# EAGLE design Solar_Charger (EAGLE 9.6.2)
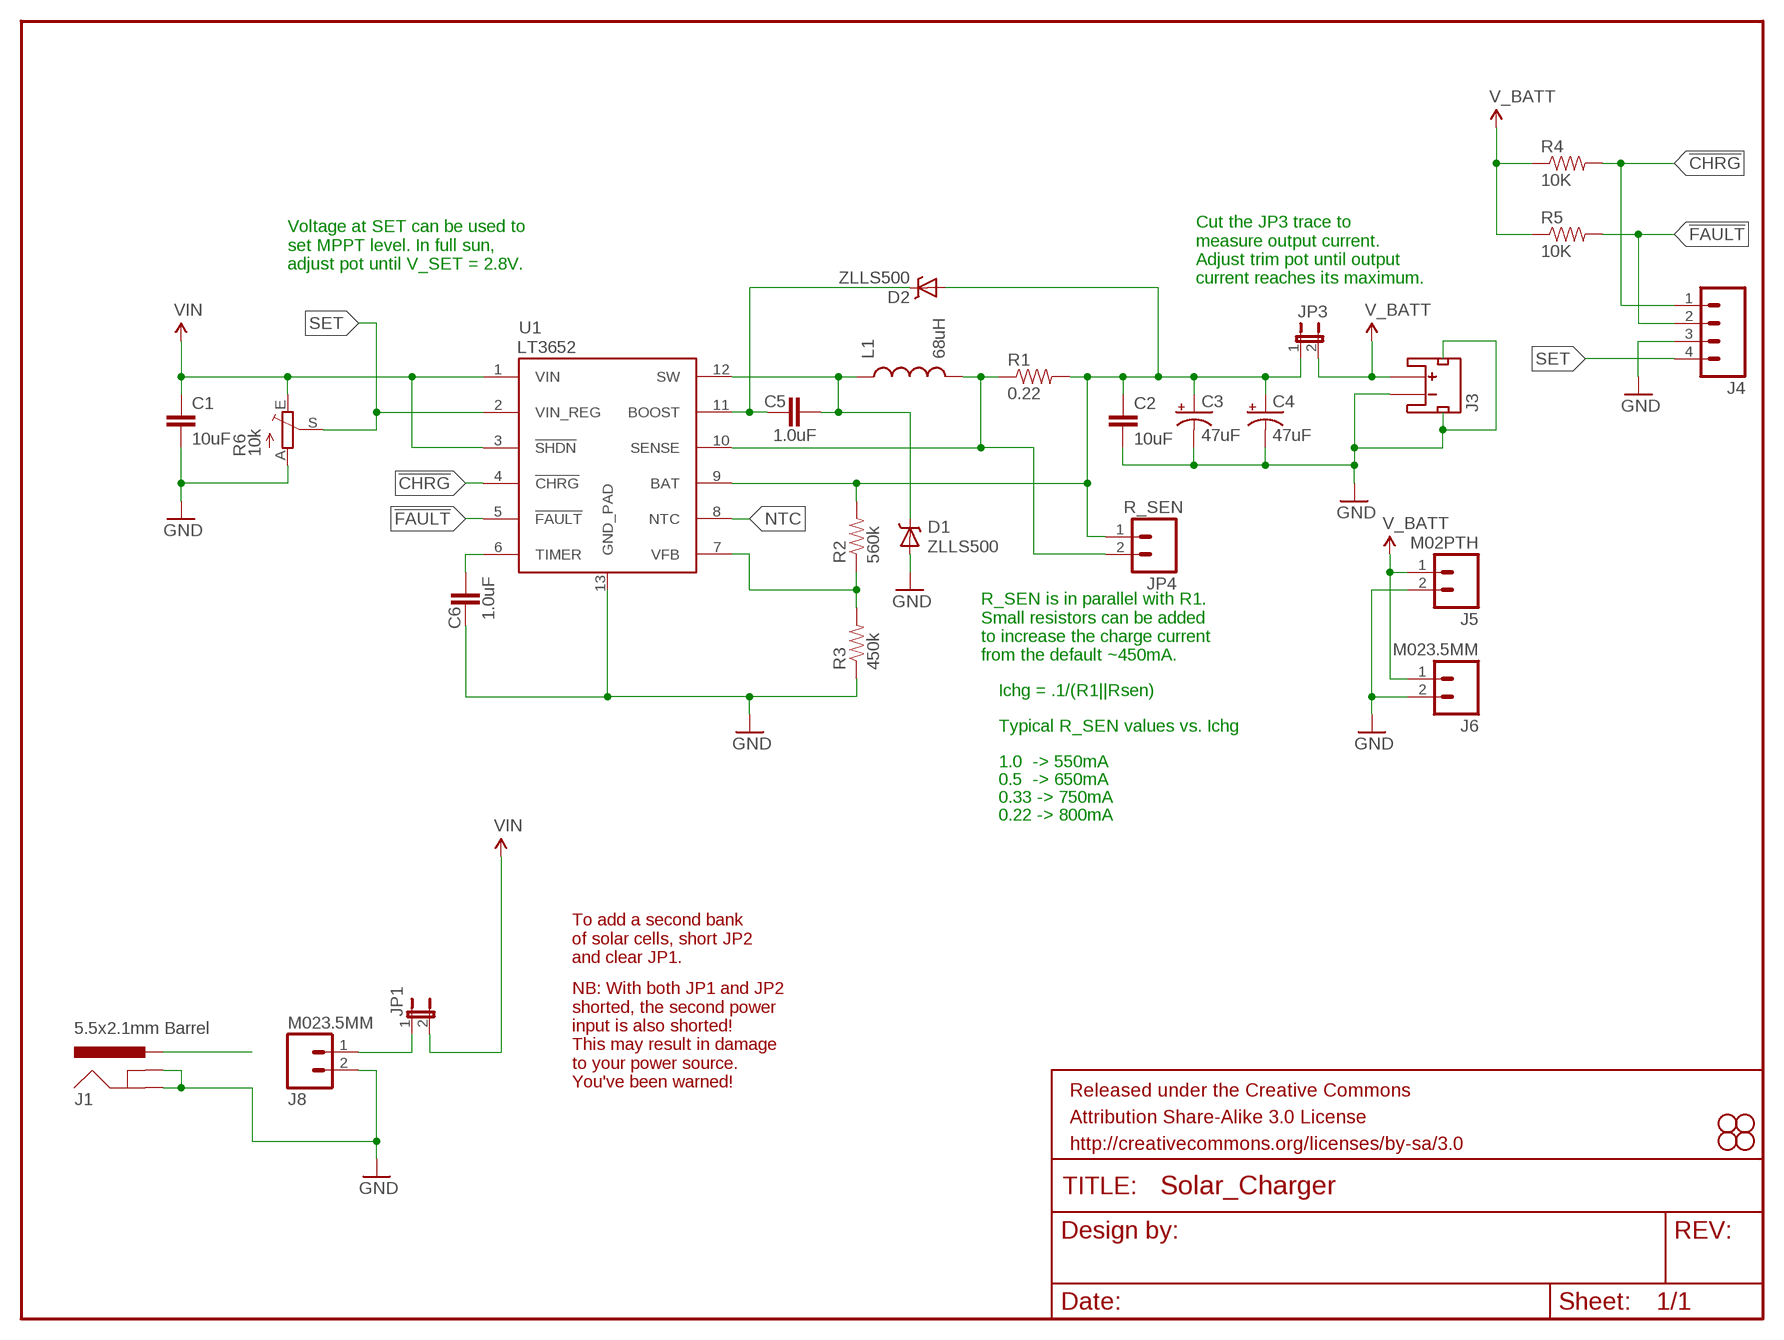
[diagram p0: schematic, sheet 1]

## Parts
C1  10uF  10UF50V20%(1210)  [1210]
C2  10uF  10UF-6.3V-20%(1206)  [1206]
C3  47uF  47UF-TANT  [EIA3528]
C4  47uF  47UF-TANT  [EIA3528]
C5  1.0uF  1.0UF-16V-10%(0603)  [0603-CAP]
C6  1.0uF  1.0UF-16V-10%(0603)  [0603-CAP]
D1  ZLLS500  ZLLS500ZLLS500  [SOT23]
D2  ZLLS500  ZLLS500ZLLS500  [SOT23]
FRAME1  FRAME-LETTER  [CREATIVE_COMMONS]
J1  5.5x2.1mm Barrel  POWER_JACKSMD  [POWER_JACK_SMD]
J3  JST_2MM_MALE  [JST-2-SMD]
J4  M04PTH  [1X04]
J5  M02PTH  [1X02]
J6  M023.5MM  [SCREWTERMINAL-3.5MM-2]
J8  M023.5MM  [SCREWTERMINAL-3.5MM-2]
JP1  JUMPER-2SMD-NC  [SJ_2S]
JP3  JUMPER-PTH-2-NC  [PTH-JUMPER-NC_BOTTOM_NO_SILK]
JP4  R_SEN  M02PTH  [1X02]
L1  68uH  INDUCTOR68UH-1A  [CR75]
R1  0.22  0.22OHM1/4W1%(0805)  [0805]
R2  560k  47KOHM1/10W1%(0603)  [0603-RES]
R3  450k  220KOHM1/10W1%(0603)  [0603-RES]
R4  10K  10KOHM1/10W1%(0603)0603  [0603-RES]
R5  10K  10KOHM1/10W1%(0603)0603  [0603-RES]
R6  10k  TRIM_EU-S63S  [S63S]
STANDOFF1  STAND-OFF  [STAND-OFF]
STANDOFF2  STAND-OFF  [STAND-OFF]
STANDOFF3  STAND-OFF  [STAND-OFF]
STANDOFF4  STAND-OFF  [STAND-OFF]
U1  LT3652  [MSOP-12_GND]

## Nets
!CHRG: J4.1 R4.2 U1.4(!CHRG)
!FAULT: J4.2 R5.2 U1.5(!FAULT)
BOOST: C5.1 D2.3(C) U1.11(BOOST)
FB: R2.1 R3.2 U1.7(VFB)
GND: C1.2 C2.2 C3.C(-) C4.C(-) C6.1 D1.1(A) J1.GND(GNDBREAK) J1.P$4(GND) J3.1(-) J3.NC1(PAD1) J3.NC2(PAD2) J4.3 J5.2 J6.2 J8.2 R3.1 R6.A U1.13(GND_PAD)
N$4: C2.1 C3.A(+) C4.A(+) D2.1(A) JP3.1 JP4.1 R1.2 R2.2 U1.9(BAT)
N$6: J1.VIN0(PWR)
N$8: J8.1 JP1.1
NTC: U1.8(NTC)
SENSE: JP4.2 L1.P$2 R1.1 U1.10(SENSE)
SET: J4.4 R6.S U1.2(VIN_REG)
SW: C5.2 D1.3(C) L1.P$1 U1.12(SW)
TIMER: C6.2 U1.6(TIMER)
V_BATT: J3.2(+) J5.1 J6.1 JP3.2 R4.1 R5.1
VIN: C1.1 JP1.2 R6.E U1.1(VIN) U1.3(!SHDN)

## Notes on the sheet
- Voltage at SET can be used to
  set MPPT level. In full sun,
  adjust pot until V_SET = 2.8V.
- Cut the JP3 trace to
  measure output current.
  Adjust trim pot until output
  current reaches its maximum.
- R_SEN is in parallel with R1.
  Small resistors can be added
  to increase the charge current
  from the default ~450mA.
- Ichg = .1/(R1||Rsen)
- Typical R_SEN values vs. Ichg
- 1.0  -> 550mA
- 0.5  -> 650mA
- 0.33 -> 750mA
- 0.22 -> 800mA
- To add a second bank
  of solar cells, short JP2
  and clear JP1.
- NB: With both JP1 and JP2
  shorted, the second power
  input is also shorted! 
  This may result in damage
  to your power source.
  You've been warned!

## Library data of the parts
C1 = SparkFun-Capacitors:10UF50V20%(1210): CAP-09824; PROD_ID: CAP-09824
C2 = SparkFun-Capacitors:10UF-6.3V-20%(1206): Ceramic CAP-10057; PROD_ID: CAP-10057
C3 C4 = SparkFun-Capacitors:47UF-TANT: 47uF Tantalum SMT CAP-08310- 10V 10% (EIA-3528); PROD_ID: CAP-08310
C5 C6 = SparkFun-Capacitors:1.0UF-16V-10%(0603): CAP-00868; PROD_ID: CAP-00868
D1 D2 = SparkFun-DiscreteSemi:ZLLS500: 700mA 40V SOT-23 Schottky; PROD_ID: DIO-08411
FRAME1 = SparkFun-Aesthetics:FRAME-LETTER: Schematic Frame Standard 8.5x11 US Letter frame
J1 = SparkFun-Connectors:POWER_JACK: Power Jack This is the standard 5.5mm barrel jack for power. The PTH is the most common, proven, reliable, footprint. The Slot footprint only works if the mill layer is transmitted to the PCB fab house so be warned. Spark Fun Electronics SKU : PRT-00119 SMT: CONN-08106 Mating wall wart : TOL-00298 (and others); PROD_ID: CONN-08106
J3 = SparkFun-Connectors:JST_2MM_MALE: Mates to single-cell LiPo batteries. CONN-08352; PROD_ID: CONN-08352
J4 = SparkFun-Connectors:M04: Header 4 Standard 4-pin 0.1" header. Use with straight break away headers (SKU : PRT-00116), right angle break away headers (PRT-00553), swiss pins (PRT-00743), machine pins (PRT-00117), and female headers (PRT-00115). Molex polarized connector foot print use with SKU : PRT-08231 with associated crimp pins and housings. 1MM SMD Version SKU: PRT-10208
J5 J6 J8 JP4 = SparkFun-Connectors:M02: Standard 2-pin 0.1" header. Use with - straight break away headers ( PRT-00116) - right angle break away headers (PRT-00553) - swiss pins (PRT-00743) - machine pins (PRT-00117) - female headers (PRT-00115) Molex polarized connector foot print use with: PRT-08233 with associated crimp pins and housings. 2.54_SCREWTERM for use with PRT-10571. 3.5mm Screw Terminal footprints for PRT-08084 5mm Screw Terminal footprints for use with PRT-08433
JP1 = SparkFun-Passives:JUMPER-2: Jumper Basic 0.1" spaced jumper. Use with breakaway headers.
JP3 = SparkFun-Passives:JUMPER-PTH-2-NC
L1 = SparkFun-Passives:INDUCTOR: Inductors Basic Inductor/Choke - 0603 and 1206. Footprints are not proven and vary greatly between part numbers. SRN6045- 33uH, 20% 1.4A SDR0403-560KL - 56uH, 10%, 500mA RMS/740mA peak; PROD_ID: NDUC-09739
R1 = SparkFun-Resistors:0.22OHM1/4W1%(0805): RES-09883; PROD_ID: RES-09883
R2 = SparkFun-Resistors:47KOHM1/10W1%(0603): RES-07871; PROD_ID: RES-07871; VALUE: 47K
R3 = SparkFun-Resistors:220KOHM1/10W1%(0603): RES-08969; PROD_ID: RES-08969; VALUE: 220k
R4 R5 = SparkFun-Resistors:10KOHM1/10W1%(0603): RES-00824; PROD_ID: RES-00824
R6 = pot:TRIM_EU-: POTENTIOMETER
STANDOFF1-STANDOFF4 = SparkFun-Electromechanical:STAND-OFF: #4 Stand Off This is the mechanical footprint for a #4 phillips button head screw. Use the keepout ring to avoid running the screw head into surrounding components. SKU : PRT-00447
U1 = SparkFun-PowerIC:LT3652: LT3652 MPPT Solar Charge Controller 5V-32V smart charger for batteries up to 14.4V

## Board
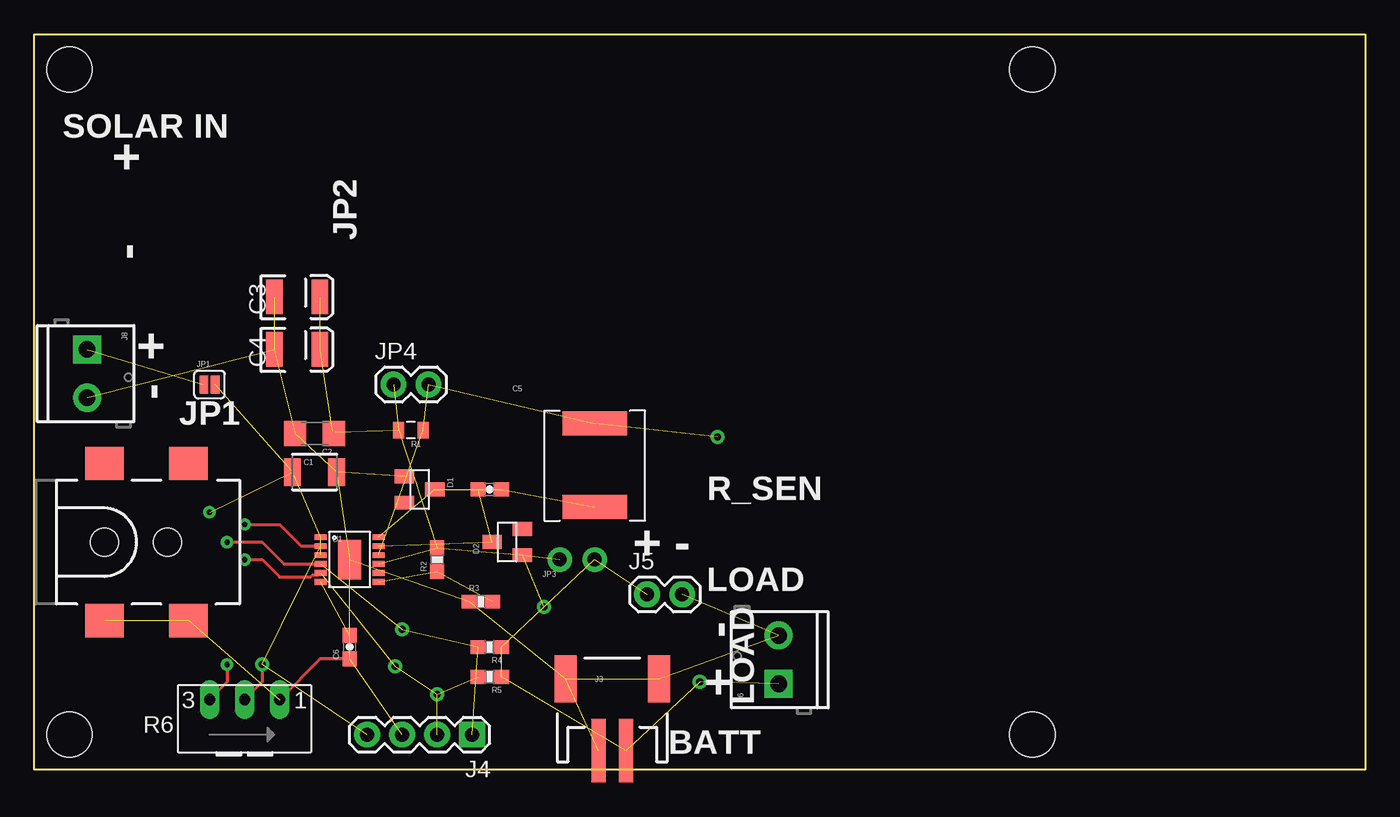
[diagram p1: board, top side]
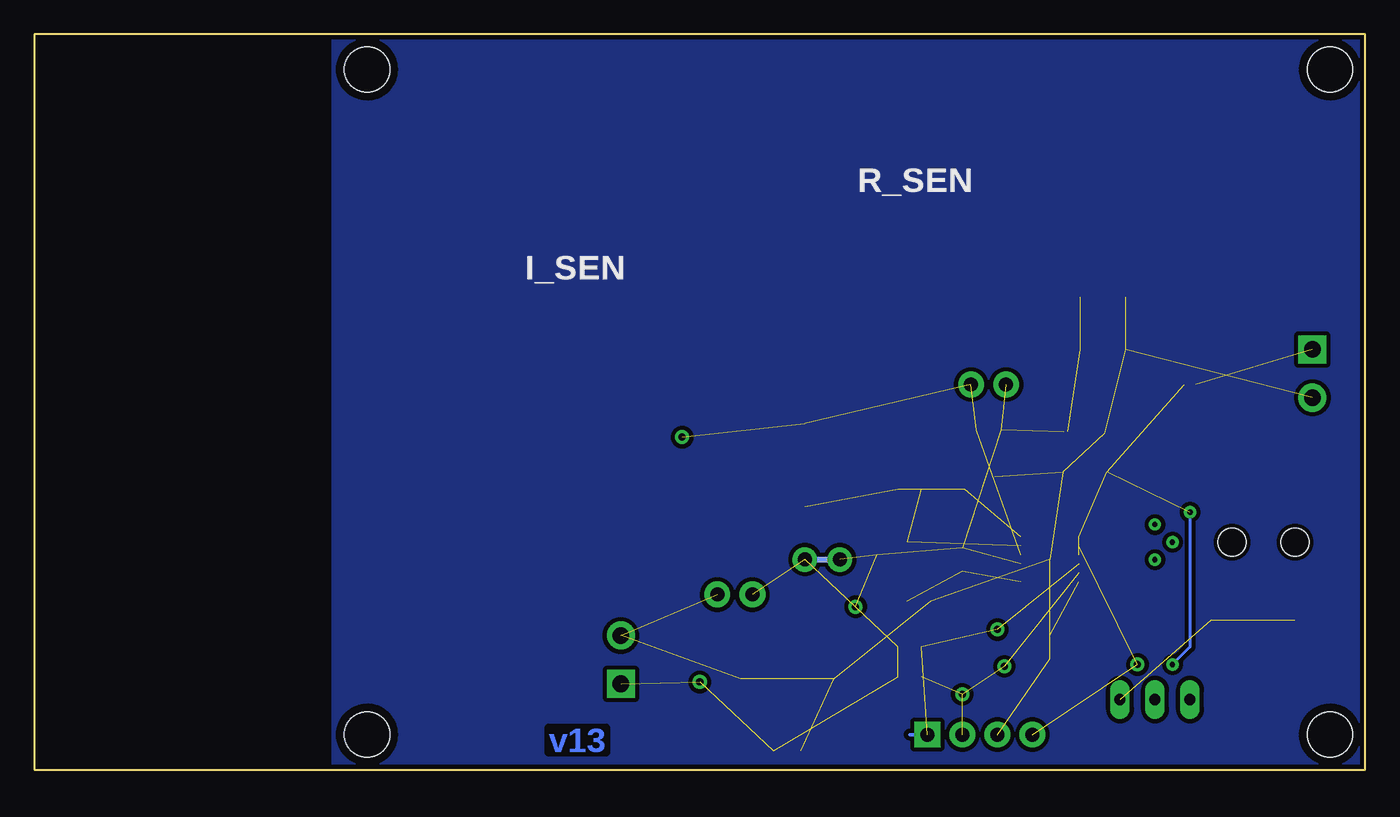
[diagram p2: board, bottom side, seen from below]

Size 96.52 x 53.34 mm. Coordinates in mm from the lower left corner, seen from the top.
Outline: 0,53.34 96.52,53.34 96.52,0 0,0 0,53.34
Copper layers (1*16): Top 0.035mm / dielectric 1.5mm / Bottom 0.035mm
Design rules "Sparkfun": minimum track width 8mil, minimum drill 20mil, track to track 8mil, track to pad 8mil, pad to pad 8mil, via to via 8mil, smd to smd 8mil, copper to edge 8mil, drill to drill 8mil, minimum pad ring 12mil, minimum via ring 10mil, stop-mask expansion 4mil, vias tented up to drill 20mil, thermal gap 10mil

### Footprints (pad centres in the part's own frame; a part is rotated, then mirrored left to right if it is on the bottom)
1210 = smd 1.2 x 2: 1 -1.6,0; 2 1.6,0
1206 = smd 1.6 x 1.8: 1 -1.4,0; 2 1.4,0
EIA3528 = smd 1.2 x 2.5: A 1.65,0; C -1.65,0
0603-CAP = smd 1.1 x 1: 1 -0.85,0; 2 0.85,0
SOT23 = smd 1 x 1.4: 1 -0.95,-1.1; 2 0.95,-1.1; 3 0,1.1
POWER_JACK_SMD = smd 2.8 x 2.4: GND 0,-5.7; P$4 6.1,-5.7; VIN0 0,5.7; VIN1 6.1,5.7 | hole 2.032: 0,0; 4.572,0
JST-2-SMD = smd 1 x 4.6: 1 -1,-3.7; 2 1,-3.7 | smd 1.6 x 3.4: NC1 -3.4,1.5; NC2 3.4,1.5
1X04 = drill 1.016 pad 1.88 square: 1 0,0 | drill 1.016 pad 1.88: 2 2.54,0; 3 5.08,0; 4 7.62,0
1X02 = drill 1.016 pad 1.88: 1 0,0; 2 2.54,0
SCREWTERMINAL-3.5MM-2 = drill 1.2 pad 2.032 square: 1 0,0 | drill 1.2 pad 2.032: 2 3.5,0
SJ_2S = smd 0.635 x 1.27: 1 -0.412,0; 2 0.412,0
PTH-JUMPER-NC_BOTTOM_NO_SILK = drill 1.016 pad 1.778: 1 -1.27,0; 2 1.27,0 | smd 1.27 x 0.381 bottom: P$1 0,0
CR75 = smd 1.75 x 4.7: P$1 0,0; P$2 6.05,0
0805 = smd 0.8 x 1.2: 1 -0.9,0; 2 0.9,0
0603-RES = smd 1.1 x 1: 1 -0.85,0; 2 0.85,0
S63S = drill 0.813 long: A 2.54,1.27; E -2.54,1.27; S 0,1.27
STAND-OFF = hole 3.302: 0,0
MSOP-12_GND = smd 0.889 x 0.42: 1 -2.1,1.625; 2 -2.1,0.975; 3 -2.1,0.325; 4 -2.1,-0.325; 5 -2.1,-0.975; 6 -2.1,-1.625; 7 2.1,-1.625; 8 2.1,-0.975; 9 2.1,-0.325; 10 2.1,0.325; 11 2.1,0.975; 12 2.1,1.625 | smd 1.651 x 2.845: 13 0,0

### Placement (x,y rotation side)
C1  20.32,21.59 0 top
C2  20.32,24.38 180 top
C3  19.05,34.29 0 top
C4  19.05,30.48 0 top
C5  33.02,20.32 0 top
C6  22.86,8.89 90 top
D1  27.94,20.32 270 top
D2  34.29,16.51 90 top
FRAME1  46.99,-26.67 0 top  (outside the outline)
J1  5.08,16.51 0 top
J3  41.91,5.08 0 top
J4  31.75,2.54 180 top
J5  44.45,12.7 0 top
J6  53.98,6.22 90 top
J8  3.81,30.48 270 top
JP1  12.7,27.94 0 top
JP3  39.37,15.24 0 top
JP4  26.04,27.94 0 top
L1  40.64,19.05 90 top
R1  27.3,24.64 180 top
R2  29.21,15.24 90 top
R3  32.38,12.19 0 top
R4  33.02,8.89 180 top
R5  33.02,6.73 180 top
R6  15.24,3.81 0 top
STANDOFF1  2.54,2.54 0 top
STANDOFF2  2.54,50.8 0 top
STANDOFF3  72.39,50.8 0 top
STANDOFF4  72.39,2.54 0 top
U1  22.86,15.24 0 top

### Tracks (layer width: path | path; a pad name or v marks a point on that pad's centre or on a via)
!CHRG  (via drill 0.38, 0.51)  (3 unrouted)
  Top 0.203: v13.97,16.51 16.51,16.51 18.11,14.91 U1.4
  Bottom 0.254: 33.02,2.54 J4.1
  other vias: 26.67,10.16
!FAULT  (via drill 0.38, 0.51)  (4 unrouted)
  Top 0.203: v15.24,15.24 16.51,15.24 17.78,13.97 20.03,13.97 20.19,14.13 20.62,14.13 U1.5
  other vias: 26.16,7.49 29.21,5.46
BOOST  (2 unrouted)
FB  (2 unrouted)
GND  (16 unrouted)
  Top 0.203: C6.1 20.74,8.04 R6.A
N$2
  pour Bottom (isolate 0.305, rank 2, no thermals): 0,53.34 74.93,53.34 74.93,0 0,0
N$4  (via drill 0.51)  (9 unrouted)
  Top 0.254: 21.59,24.51 C2.1
  Top 1.016: 21.84,24.51 C2.1
  other vias: 36.96,11.81
N$8  (1 unrouted)
SENSE  (via drill 0.51)  (4 unrouted)
  other vias: 49.53,24.13
SET  (via drill 0.38, 0.51)  (2 unrouted)
  Top 0.203: v16.51,7.62 16.51,6.35 R6.S | 20.62,16.35 U1.2 19.34,16.21 17.78,17.78 v15.24,17.78
SW  (3 unrouted)
TIMER  (1 unrouted)
V_BATT  (via drill 0.51)  (6 unrouted)
  other vias: 48.26,6.35
VIN  (via drill 0.38)  (4 unrouted)
  Top 0.203: v13.97,7.62 13.97,6.35 R6.E
  Bottom 0.203: v12.7,18.67 12.7,8.89 v13.97,7.62

### Text on the board
Bottom: v13
tPlace: SOLAR IN | + | JP2 | - | + | - | JP1 | R_SEN | + | - | LOAD | - | + | LOAD | BATT
bPlace: R_SEN | I_SEN
tDocu: M. Hord